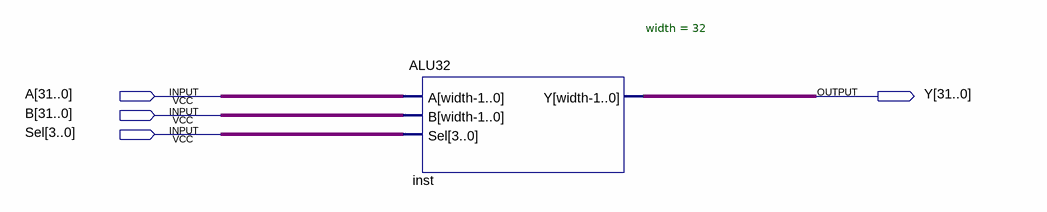
[diagram p0: schematic sheet]
// Quartus schematic ALU_32_bit.bdf as structural Verilog: 1 symbols, 4 pins
module ALU_32_bit (
  input  [31:0] A,
  input  [31:0] B,
  input  [3:0] Sel,
  output [31:0] Y
);

  ALU32 #(.width(32)) inst (.A(A), .B(B), .Sel(Sel), .Y(Y));
endmodule
